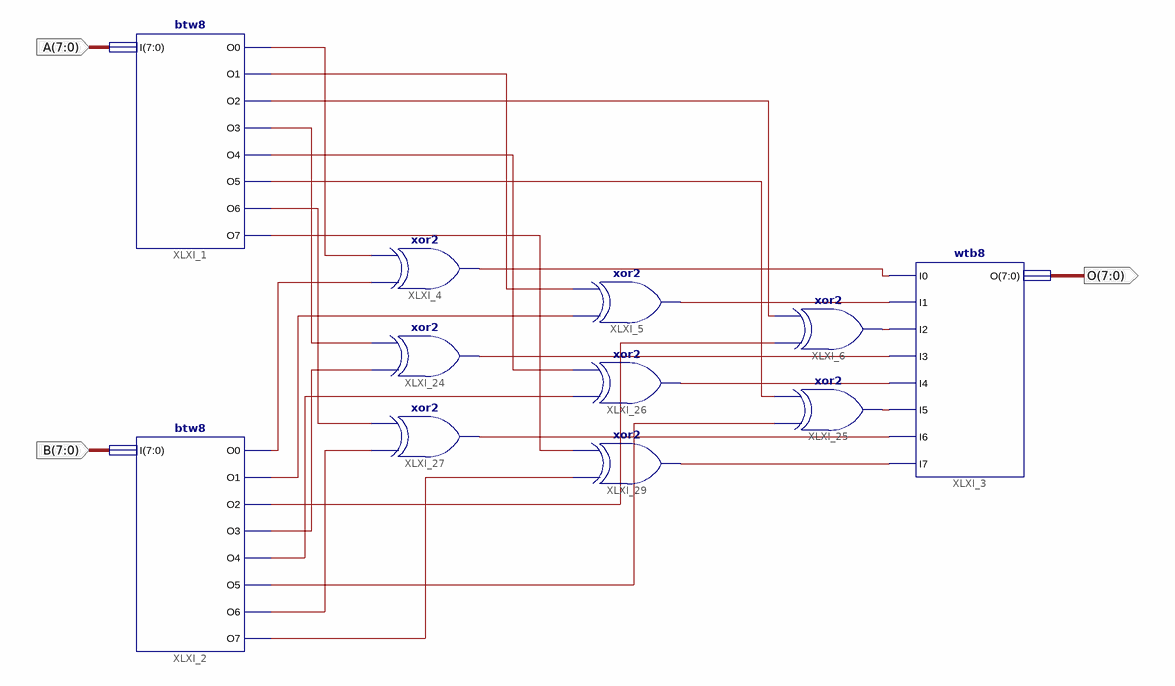
[diagram p0: schematic sheet 1]
// Xilinx ISE schematic xor8_sep.sch (spartan6) as structural Verilog: 11 symbols, 3 ports
module xor8_sep (
  input  [7:0] A,
  input  [7:0] B,
  output [7:0] O
);

  wire XLXN_3, XLXN_4, XLXN_5, XLXN_6, XLXN_7, XLXN_8, XLXN_9, XLXN_10, XLXN_12, XLXN_13, XLXN_14, XLXN_15,
       XLXN_16, XLXN_17, XLXN_18, XLXN_19, XLXN_20, XLXN_21, XLXN_22, XLXN_23, XLXN_24, XLXN_25, XLXN_26,
       XLXN_27;

  btw8 XLXI_1 (
    .I(A), .O0(XLXN_12), .O1(XLXN_14), .O2(XLXN_16), .O3(XLXN_18), .O4(XLXN_20), .O5(XLXN_22), .O6(XLXN_24),
    .O7(XLXN_27));
  btw8 XLXI_2 (
    .I(B), .O0(XLXN_13), .O1(XLXN_15), .O2(XLXN_17), .O3(XLXN_19), .O4(XLXN_21), .O5(XLXN_23), .O6(XLXN_25),
    .O7(XLXN_26));
  xor XLXI_24 (XLXN_6, XLXN_19, XLXN_18);
  wtb8 XLXI_3 (
    .I0(XLXN_3), .I1(XLXN_4), .I2(XLXN_5), .I3(XLXN_6), .I4(XLXN_7), .I5(XLXN_8), .I6(XLXN_9), .I7(XLXN_10),
    .O(O));
  xor XLXI_6 (XLXN_5, XLXN_17, XLXN_16);
  xor XLXI_25 (XLXN_8, XLXN_23, XLXN_22);
  xor XLXI_5 (XLXN_4, XLXN_15, XLXN_14);
  xor XLXI_26 (XLXN_7, XLXN_21, XLXN_20);
  xor XLXI_29 (XLXN_10, XLXN_26, XLXN_27);
  xor XLXI_4 (XLXN_3, XLXN_13, XLXN_12);
  xor XLXI_27 (XLXN_9, XLXN_25, XLXN_24);
endmodule
